# Altium project PCB_Controle.PrjPcb
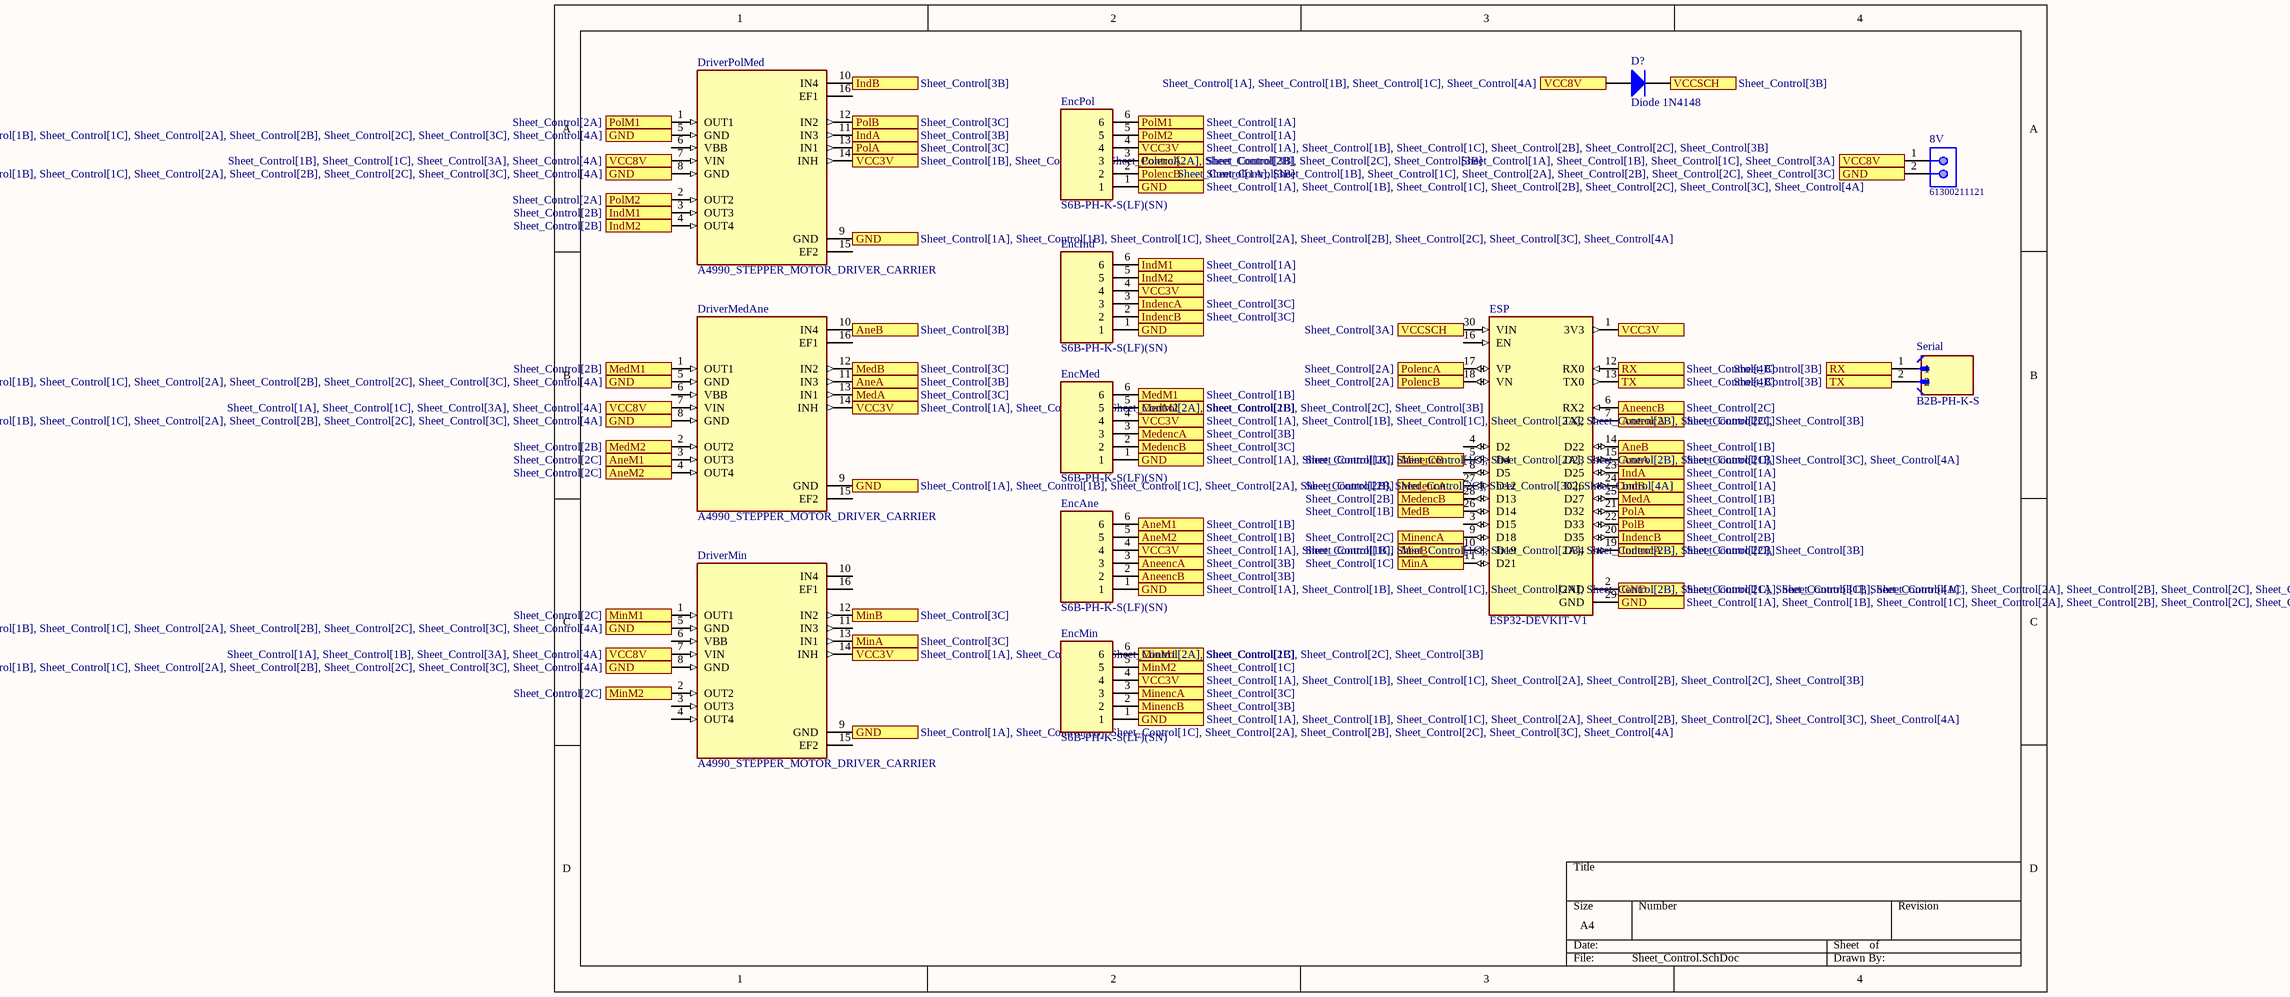
[diagram p0: Sheet_Control.SchDoc]
1 sheet, 12 parts. Net scope: flat (ports and power ports of the same name join across sheets).
Board file: PCB_Controlev2.PcbDoc

## Sheet Sheet_Control.SchDoc
size A4; SheetNumber: 1; SheetTotal: 1

### Parts
8V  61300211121  [61300211121]
D1  Diode 1N4148  [DO-35]
DriverMedAne  A4990_STEPPER_MOTOR_DRIVER_CARRIER  [MODULE_A4990_STEPPER_MOTOR_DRIVER_CARRIER]
DriverMin  A4990_STEPPER_MOTOR_DRIVER_CARRIER  [MODULE_A4990_STEPPER_MOTOR_DRIVER_CARRIER]
DriverPolMed  A4990_STEPPER_MOTOR_DRIVER_CARRIER  [MODULE_A4990_STEPPER_MOTOR_DRIVER_CARRIER]
EncAne  S6B-PH-K-S(LF)(SN)  [JST_S6B-PH-K-S(LF)(SN)]
EncInd  S6B-PH-K-S(LF)(SN)  [JST_S6B-PH-K-S(LF)(SN)]
EncMed  S6B-PH-K-S(LF)(SN)  [JST_S6B-PH-K-S(LF)(SN)]
EncMin  S6B-PH-K-S(LF)(SN)  [JST_S6B-PH-K-S(LF)(SN)]
EncPol  S6B-PH-K-S(LF)(SN)  [JST_S6B-PH-K-S(LF)(SN)]
ESP  ESP32-DEVKIT-V1  [ESP32_DEVKIT_V1]
Serial  B2B-PH-K-S  [JST_B2B-PH-K-S]

### Ports
AneA (in, see Sheet_Control[3B]), AneA (out, see Sheet_Control[1B]), AneB (in, see Sheet_Control[3B]), AneB (out, see Sheet_Control[1B]), AneencA (in, see Sheet_Control[2C]), AneencA (out, see Sheet_Control[3B]), AneencB (in, see Sheet_Control[2C]), AneencB (out, see Sheet_Control[3B]), AneM1 (in, see Sheet_Control[1B]), AneM1 (out, see Sheet_Control[2C]), AneM2 (in, see Sheet_Control[1B]), AneM2 (out, see Sheet_Control[2C]), GND, GND (see Sheet_Control[1A], Sheet_Control[1B], Sheet_Control[1C], Sheet_Control[2A], Sheet_Control[2B], Sheet_Control[2C], Sheet_Control[3C]), GND (see Sheet_Control[1A], Sheet_Control[1B], Sheet_Control[1C], Sheet_Control[2A], Sheet_Control[2B], Sheet_Control[2C], Sheet_Control[3C], Sheet_Control[4A]), GND (see Sheet_Control[1A], Sheet_Control[1B], Sheet_Control[1C], Sheet_Control[2B], Sheet_Control[2C], Sheet_Control[3C], Sheet_Control[4A]), IndA (in, see Sheet_Control[3B]), IndA (out, see Sheet_Control[1A]), IndB (in, see Sheet_Control[3B]), IndB (out, see Sheet_Control[1A]), IndencA (in, see Sheet_Control[2B]), IndencA (out, see Sheet_Control[3C]), IndencB (in, see Sheet_Control[2B]), IndencB (out, see Sheet_Control[3C]), IndM1 (in, see Sheet_Control[1A]), IndM1 (out, see Sheet_Control[2B]), IndM2 (in, see Sheet_Control[1A]), IndM2 (out, see Sheet_Control[2B]), MedA (in, see Sheet_Control[3C]), MedA (out, see Sheet_Control[1B]), MedB (in, see Sheet_Control[3C]), MedB (out, see Sheet_Control[1B]), MedencA (in, see Sheet_Control[2B]), MedencA (out, see Sheet_Control[3B]), MedencB (in, see Sheet_Control[2B]), MedencB (out, see Sheet_Control[3C]), MedM1 (in, see Sheet_Control[1B]), MedM1 (out, see Sheet_Control[2B]), MedM2 (in, see Sheet_Control[1B]), MedM2 (out, see Sheet_Control[2B]), MinA (in, see Sheet_Control[3C]), MinA (out, see Sheet_Control[1C]), MinB (in, see Sheet_Control[3C]), MinB (out, see Sheet_Control[1C]), MinencA (in, see Sheet_Control[2C]), MinencA (out, see Sheet_Control[3C]), MinencB (in, see Sheet_Control[2C]), MinencB (out, see Sheet_Control[3B]), MinM1 (in, see Sheet_Control[1C]), MinM1 (out, see Sheet_Control[2C]), MinM2 (in, see Sheet_Control[1C]), MinM2 (out, see Sheet_Control[2C]), PolA (in, see Sheet_Control[3C]), PolA (out, see Sheet_Control[1A]), PolB (in, see Sheet_Control[3C]), PolB (out, see Sheet_Control[1A]), PolencA (in, see Sheet_Control[2A]), PolencA (out, see Sheet_Control[3B]), PolencB (in, see Sheet_Control[2A]), PolencB (out, see Sheet_Control[3B]), PolM1 (in, see Sheet_Control[1A]), PolM1 (out, see Sheet_Control[2A]), PolM2 (in, see Sheet_Control[1A]), PolM2 (out, see Sheet_Control[2A]), RX (in, see Sheet_Control[4B]), RX (out, see Sheet_Control[3B]), TX (in, see Sheet_Control[3B]), TX (out, see Sheet_Control[4B]), VCC3V, VCC3V (in), VCC3V (in, see Sheet_Control[1A], Sheet_Control[1B], Sheet_Control[1C], Sheet_Control[2A], Sheet_Control[2B], Sheet_Control[2C], Sheet_Control[3B]), VCC3V (in, see Sheet_Control[1A], Sheet_Control[1B], Sheet_Control[1C], Sheet_Control[2B], Sheet_Control[2C], Sheet_Control[3B]), VCC3V (see Sheet_Control[1A], Sheet_Control[1B], Sheet_Control[2A], Sheet_Control[2B], Sheet_Control[2C], Sheet_Control[3B]), VCC3V (see Sheet_Control[1A], Sheet_Control[1C], Sheet_Control[2A], Sheet_Control[2B], Sheet_Control[2C], Sheet_Control[3B]), VCC3V (see Sheet_Control[1B], Sheet_Control[1C], Sheet_Control[2A], Sheet_Control[2B], Sheet_Control[2C], Sheet_Control[3B]), VCC8V (see Sheet_Control[1A], Sheet_Control[1B], Sheet_Control[1C], Sheet_Control[3A]), VCC8V (see Sheet_Control[1A], Sheet_Control[1B], Sheet_Control[1C], Sheet_Control[4A]), VCC8V (see Sheet_Control[1A], Sheet_Control[1B], Sheet_Control[3A], Sheet_Control[4A]), VCC8V (see Sheet_Control[1A], Sheet_Control[1C], Sheet_Control[3A], Sheet_Control[4A]), VCC8V (see Sheet_Control[1B], Sheet_Control[1C], Sheet_Control[3A], Sheet_Control[4A]), VCCSCH (see Sheet_Control[3A]), VCCSCH (see Sheet_Control[3B])

### Nets
Net8V_1: 8V.1 D1.1(A) DriverMedAne.7(VIN) DriverMin.7(VIN) DriverPolMed.7(VIN) ; port VCC8V
Net8V_2: 8V.2 DriverMedAne.5(GND) DriverMedAne.8(GND) DriverMedAne.9(GND) DriverMin.5(GND) DriverMin.8(GND) DriverMin.9(GND) DriverPolMed.5(GND) DriverPolMed.8(GND) DriverPolMed.9(GND) EncAne.1 EncInd.1 EncMed.1 EncMin.1 EncPol.1 ESP.2(GND) ESP.29(GND) ; port GND
NetD1_2: D1.2(K) ESP.30(VIN) ; port VCCSCH
NetDriverMedAne_1: DriverMedAne.1(OUT1) EncMed.6 ; port MedM1
NetDriverMedAne_2: DriverMedAne.2(OUT2) EncMed.5 ; port MedM2
NetDriverMedAne_3: DriverMedAne.3(OUT3) EncAne.6 ; port AneM1
NetDriverMedAne_4: DriverMedAne.4(OUT4) EncAne.5 ; port AneM2
NetDriverMedAne_10: DriverMedAne.10(IN4) ESP.14(D22) ; port AneB
NetDriverMedAne_11: DriverMedAne.11(IN3) ESP.15(D23) ; port AneA
NetDriverMedAne_12: DriverMedAne.12(IN2) ESP.26(D14) ; port MedB
NetDriverMedAne_13: DriverMedAne.13(IN1) ESP.25(D27) ; port MedA
NetDriverMedAne_14: DriverMedAne.14(INH) DriverMin.14(INH) DriverPolMed.14(INH) EncAne.4 EncInd.4 EncMed.4 EncMin.4 EncPol.4 ESP.1(3V3) ; port VCC3V
NetDriverMin_1: DriverMin.1(OUT1) EncMin.6 ; port MinM1
NetDriverMin_2: DriverMin.2(OUT2) EncMin.5 ; port MinM2
NetDriverMin_12: DriverMin.12(IN2) ESP.10(D19) ; port MinB
NetDriverMin_13: DriverMin.13(IN1) ESP.11(D21) ; port MinA
NetDriverPolMed_1: DriverPolMed.1(OUT1) EncPol.6 ; port PolM1
NetDriverPolMed_2: DriverPolMed.2(OUT2) EncPol.5 ; port PolM2
NetDriverPolMed_3: DriverPolMed.3(OUT3) EncInd.6 ; port IndM1
NetDriverPolMed_4: DriverPolMed.4(OUT4) EncInd.5 ; port IndM2
NetDriverPolMed_10: DriverPolMed.10(IN4) ESP.24(D26) ; port IndB
NetDriverPolMed_11: DriverPolMed.11(IN3) ESP.23(D25) ; port IndA
NetDriverPolMed_12: DriverPolMed.12(IN2) ESP.22(D33) ; port PolB
NetDriverPolMed_13: DriverPolMed.13(IN1) ESP.21(D32) ; port PolA
NetEncAne_2: EncAne.2 ESP.6(RX2) ; port AneencB
NetEncAne_3: EncAne.3 ESP.7(TX2) ; port AneencA
NetEncInd_2: EncInd.2 ESP.20(D35) ; port IndencB
NetEncInd_3: EncInd.3 ESP.19(D34) ; port IndencA
NetEncMed_2: EncMed.2 ESP.28(D13) ; port MedencB
NetEncMed_3: EncMed.3 ESP.27(D12) ; port MedencA
NetEncMin_2: EncMin.2 ESP.5(D4) ; port MinencB
NetEncMin_3: EncMin.3 ESP.9(D18) ; port MinencA
NetEncPol_2: EncPol.2 ESP.18(VN) ; port PolencB
NetEncPol_3: EncPol.3 ESP.17(VP) ; port PolencA
NetESP_12: ESP.12(RX0) Serial.1 ; port RX
NetESP_13: ESP.13(TX0) Serial.2 ; port TX

Not connected (* = marked no-connect by the designer): DriverMedAne 6(VBB) 15(EF2) 16(EF1); DriverMin 3(OUT3) 4(OUT4) 6(VBB) 10(IN4) 11(IN3) 15(EF2) 16(EF1); DriverPolMed 6(VBB) 15(EF2) 16(EF1); ESP 3(D15) 4(D2) 8(D5) 16(EN)

### Library data of the parts
8V = 61300211121: WR-PHD Pin Header, THT, pitch 2.54mm, Single Row, Vertical, 2pin; Pin Number: 2; Gender: Male; Rated Current: 3A; Working Voltage: 250VAC; Withstanding Voltage: 500VAC; Contact Resistance: 20mOhm; ComponentLink1Description: Manufacturer; ComponentLink1URL: http://www.we-online.de; ComponentLink2Description: Datasheet; ComponentLink2URL: https://katalog.we-online.de/em/datasheet/6130xx11121.pdf; Part Number: 61300211121; Published Date: June 2019; Publisher: Wurth Elektronik; Pitch: 2.54mm; Operating Temperature: -40 to +105degC; Mounting Technology: THT; Packaging: Bag; Row Number: Single; Orientation: Vertical
D1 = Diode 1N4148: High Conductance Fast Diode; Published: 8-Jun-2000; LatestRevisionDate: 17-Jul-2002; LatestRevisionNote: Re-released for DXP Platform.; DatasheetVersion: 1997; PackageReference: DO-35; Publisher: Altium Limited; PackageDescription: Diode, Axial; Body 3.8 x 1.9 mm (LxDia. max), Lead Dia. 0.53 mm (max); Code_JEDEC: DO-204-AH; ComponentLink1Description: Manufacturer Link; ComponentLink1URL: http://www.fairchildsemi.com/; ComponentLink2Description: Datasheet; ComponentLink2URL: http://www.fairchildsemi.com/ds/1N%2F1N4148.pdf
DriverMedAne DriverMin DriverPolMed = A4990_STEPPER_MOTOR_DRIVER_CARRIER: Stepper motor controler; IC: A4990; MP: A4988_STEPPER_MOTOR_DRIVER_CARRIER; Price: None; Value: *; Package: None; Availability: Unavailable
EncAne EncInd EncMed EncMin EncPol = S6B-PH-K-S(LF)(SN): PH Series 6 Position 2 mm Pitch Through Hole Side Entry Shrouded Header; Price: None; Value: *; Package: None; Availability: Unavailable; MP: S6B-PH-K-S(LF)(SN)
ESP = ESP32-DEVKIT-V1: Dual core, Wi-Fi: 2.4 GHz up to 150 Mbits/s,BLE (Bluetooth Low Energy) and legacy Bluetooth, 32 bits, Up to 240 MHz; MF: Do it; Value: *; MP: ESP32-DEVKIT-V1; SnapEDA_Link: https://www.snapeda.com/parts/ESP32-DEVKIT-V1/Do+it/view-part/?ref=snap; Price: None; Package: None; Check_prices: https://www.snapeda.com/parts/ESP32-DEVKIT-V1/Do+it/view-part/?ref=eda; Availability: Not in stock
Serial = B2B-PH-K-S: Connector Header Through Hole 2 position 0.079 (2.00mm); MF: JST Sales America Inc.; SnapEDA_Link: https://www.snapeda.com/parts/B2B-PH-K-S/JST/view-part/?ref=snap; Package: None; Value: *; MP: B2B-PH-K-S; Check_prices: https://www.snapeda.com/parts/B2B-PH-K-S/JST/view-part/?ref=eda